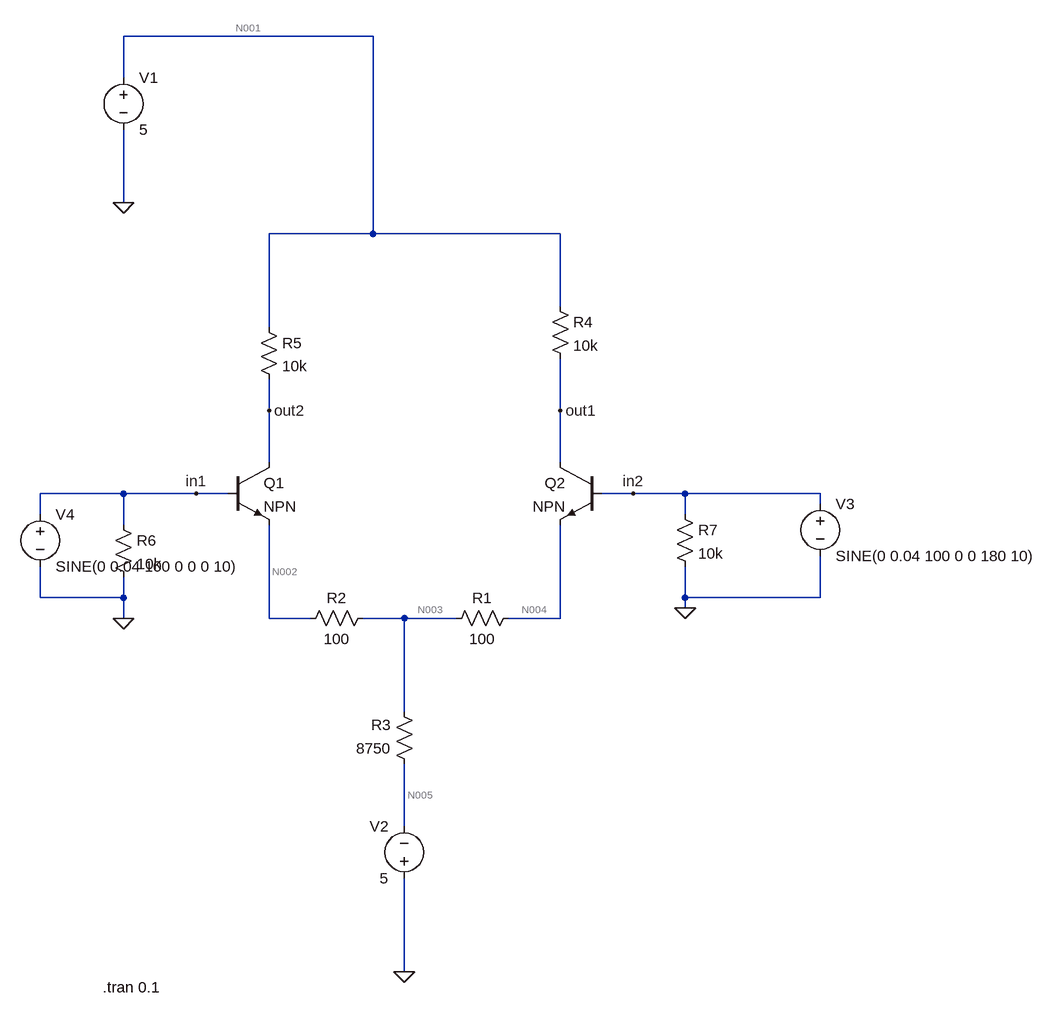
[diagram p0: schematic Draft2.asc]
Draft2.asc, the LTspice schematic file:
Version 4
SHEET 1 1024 1032
WIRE -256 -448 -640 -448
WIRE -640 -384 -640 -448
WIRE -640 -192 -640 -304
WIRE -256 -144 -256 -448
WIRE -256 -144 -416 -144
WIRE 32 -144 -256 -144
WIRE 32 -32 32 -144
WIRE -416 0 -416 -144
WIRE -416 128 -416 80
WIRE 32 128 32 48
WIRE -416 208 -416 128
WIRE 32 208 32 128
WIRE -640 256 -768 256
WIRE -528 256 -640 256
WIRE -480 256 -528 256
WIRE 144 256 96 256
WIRE 224 256 144 256
WIRE 432 256 224 256
WIRE 432 272 432 256
WIRE -768 288 -768 256
WIRE 224 288 224 256
WIRE -640 304 -640 256
WIRE -768 416 -768 368
WIRE -640 416 -640 384
WIRE -640 416 -768 416
WIRE 224 416 224 368
WIRE 432 416 432 352
WIRE 432 416 224 416
WIRE 224 432 224 416
WIRE -640 448 -640 416
WIRE -416 448 -416 304
WIRE -352 448 -416 448
WIRE -208 448 -272 448
WIRE -128 448 -208 448
WIRE 32 448 32 304
WIRE 32 448 -48 448
WIRE -208 592 -208 448
WIRE -208 768 -208 672
WIRE -208 992 -208 848
FLAG -640 448 0
FLAG 224 432 0
FLAG -640 -192 0
FLAG -208 992 0
FLAG -528 256 in1
FLAG 144 256 in2
FLAG 32 128 out1
FLAG -416 128 out2
SYMBOL npn -480 208 R0
SYMATTR InstName Q1
SYMBOL npn 96 208 M0
SYMATTR InstName Q2
SYMBOL res -32 432 R90
WINDOW 0 0 56 VBottom 2
WINDOW 3 32 56 VTop 2
SYMATTR InstName R1
SYMATTR Value 100
SYMBOL res -256 432 R90
WINDOW 0 0 56 VBottom 2
WINDOW 3 32 56 VTop 2
SYMATTR InstName R2
SYMATTR Value 100
SYMBOL res -192 688 R180
WINDOW 0 36 76 Left 2
WINDOW 3 36 40 Left 2
SYMATTR InstName R3
SYMATTR Value 8750
SYMBOL res 16 -48 R0
SYMATTR InstName R4
SYMATTR Value 10k
SYMBOL res -432 -16 R0
SYMATTR InstName R5
SYMATTR Value 10k
SYMBOL voltage -640 -400 R0
WINDOW 123 0 0 Left 0
WINDOW 39 0 0 Left 0
SYMATTR InstName V1
SYMATTR Value 5
SYMBOL voltage -208 864 R180
WINDOW 0 24 96 Left 2
WINDOW 3 24 16 Left 2
WINDOW 123 0 0 Left 0
WINDOW 39 0 0 Left 0
SYMATTR InstName V2
SYMATTR Value 5
SYMBOL res -656 288 R0
SYMATTR InstName R6
SYMATTR Value 10k
SYMBOL res 208 272 R0
SYMATTR InstName R7
SYMATTR Value 10k
SYMBOL voltage 432 256 R0
WINDOW 123 0 0 Left 0
WINDOW 39 0 0 Left 0
SYMATTR InstName V3
SYMATTR Value SINE(0 0.04 100 0 0 180 10)
SYMBOL voltage -768 272 R0
WINDOW 123 0 0 Left 0
WINDOW 39 0 0 Left 0
SYMATTR InstName V4
SYMATTR Value SINE(0 0.04 100 0 0 0 10)
TEXT -672 1016 Left 2 !.tran 0.1

The netlist it stands for:
* Draft2.asc
Q1 out2 in1 N002 0 NPN
Q2 out1 in2 N004 0 NPN
R1 N004 N003 100
R2 N003 N002 100
R3 N005 N003 8750
R4 N001 out1 10k
R5 N001 out2 10k
V1 N001 0 5
V2 0 N005 5
R6 in1 0 10k
R7 in2 0 10k
V3 in2 0 SINE(0 0.04 100 0 0 180 10)
V4 in1 0 SINE(0 0.04 100 0 0 0 10)
.model NPN NPN
.model PNP PNP
.lib standard.bjt
.tran 0.1
.backanno
.end

* Results of the author's LTspice run, read from the files saved beside the schematic
* Operating Point, zero values left out:
*   V(out2) = 2.602 V
*   V(n002) = -737.3 mV
*   V(out1) = 2.602 V
*   V(n004) = -737.3 mV
*   V(n003) = -761.5 mV
*   V(n005) = -5 V
*   V(n001) = 5 V
*   Ic(Q1) = 239.8 µA
*   Ib(Q1) = 2.398 µA
*   Ie(Q1) = -242.2 µA
*   Ic(Q2) = 239.8 µA
*   Ib(Q2) = 2.398 µA
*   Ie(Q2) = -242.2 µA
*   I(R1) = 242.2 µA
*   I(R2) = -242.2 µA
*   I(R3) = -484.4 µA
*   I(R4) = 239.8 µA
*   I(R5) = 239.8 µA
*   I(V1) = -479.6 µA
*   I(V2) = -484.4 µA
*   I(V3) = -2.398 µA
*   I(V4) = -2.398 µA
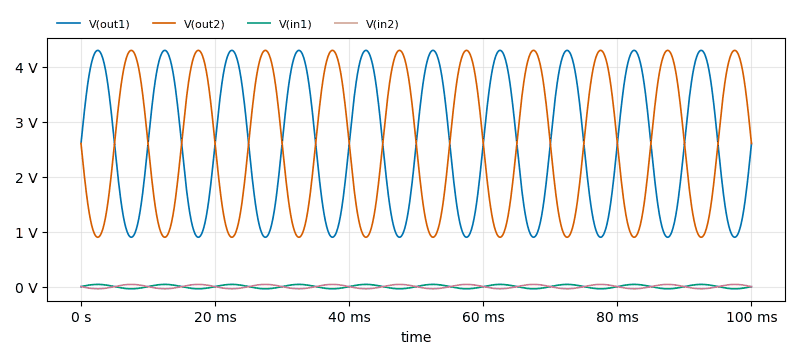
[diagram p1: Transient Analysis of Draft2.asc, plotted from the saved traces]
* Transient Analysis, 1 run:
*   V(out1): min 897.7 mV, max 4.296 V, average 2.6 V, rms 2.881 V, last 2.602 V
*   V(out2): min 897.7 mV, max 4.296 V, average 2.6 V, rms 2.881 V, last 2.602 V
*   V(in1): min -40 mV, max 40 mV, average -48.94 nV, rms 28.31 mV, last 0 V
*   V(in2): min -40 mV, max 40 mV, average 48.94 nV, rms 28.31 mV, last 0 V